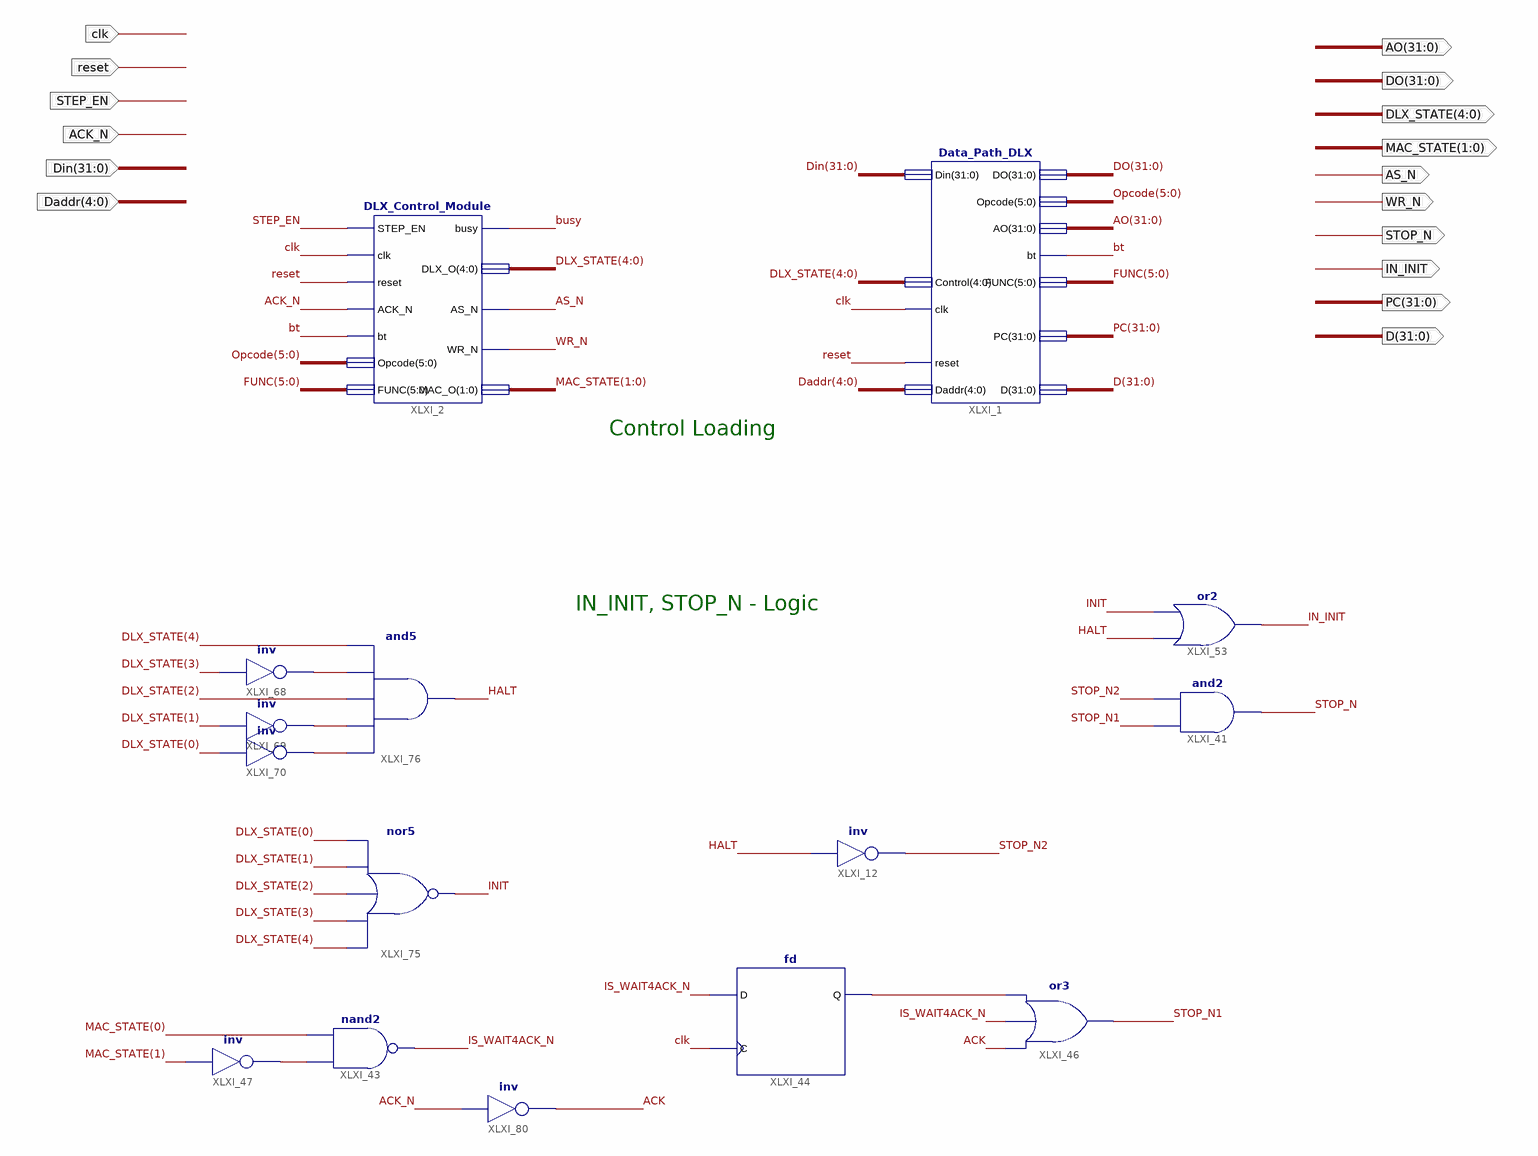
[diagram p0: schematic sheet 1]
// Xilinx ISE schematic DLX_MACHINE.sch (spartan6) as structural Verilog: 15 symbols, 17 ports
module DLX_MACHINE (
  input  clk,
  input  reset,
  input  STEP_EN,
  input  ACK_N,
  input  [31:0] Din,
  input  [4:0] Daddr,
  output AS_N,
  output WR_N,
  output [31:0] AO,
  output [31:0] DO,
  output [1:0] MAC_STATE,
  output INIT,
  output STOP_N,
  output [31:0] PC,
  output [31:0] D,
  output IN_INIT,
  output [4:0] DLX_STATE
);

  wire ACK, bt, busy, HALT, IS_WAIT4ACK_N, STOP_N1, STOP_N2, XLXN_112, XLXN_116, XLXN_141, XLXN_143, XLXN_146;
  wire [5:0] FUNC, Opcode;

  DLX_Control_Module XLXI_2 (
    .STEP_EN(STEP_EN), .clk(clk), .reset(reset), .ACK_N(ACK_N), .bt(bt), .Opcode(Opcode), .FUNC(FUNC),
    .busy(busy), .AS_N(AS_N), .WR_N(WR_N), .MAC_O(MAC_STATE), .DLX_O(DLX_STATE));
  Data_Path_DLX XLXI_1 (
    .clk(clk), .Din(Din), .reset(reset), .Daddr(Daddr), .Control(DLX_STATE), .DO(DO), .PC(PC),
    .Opcode(Opcode), .AO(AO), .bt(bt), .D(D), .FUNC(FUNC));
  not XLXI_12 (STOP_N2, HALT);
  nand XLXI_43 (IS_WAIT4ACK_N, XLXN_112, MAC_STATE[0]);
  not XLXI_47 (XLXN_112, MAC_STATE[1]);
  fd XLXI_44 (.C(clk), .D(IS_WAIT4ACK_N), .Q(XLXN_116));
  or XLXI_46 (STOP_N1, ACK, IS_WAIT4ACK_N, XLXN_116);
  or XLXI_53 (IN_INIT, HALT, INIT);
  and XLXI_41 (STOP_N, STOP_N1, STOP_N2);
  nor XLXI_75 (INIT, DLX_STATE[4], DLX_STATE[3], DLX_STATE[2], DLX_STATE[1], DLX_STATE[0]);
  and XLXI_76 (HALT, XLXN_146, XLXN_143, DLX_STATE[2], XLXN_141, DLX_STATE[4]);
  not XLXI_68 (XLXN_141, DLX_STATE[3]);
  not XLXI_69 (XLXN_143, DLX_STATE[1]);
  not XLXI_70 (XLXN_146, DLX_STATE[0]);
  not XLXI_80 (ACK, ACK_N);

  // Notes on the sheet:
  //   Control Loading
  //   IN_INIT, STOP_N - Logic
endmodule
